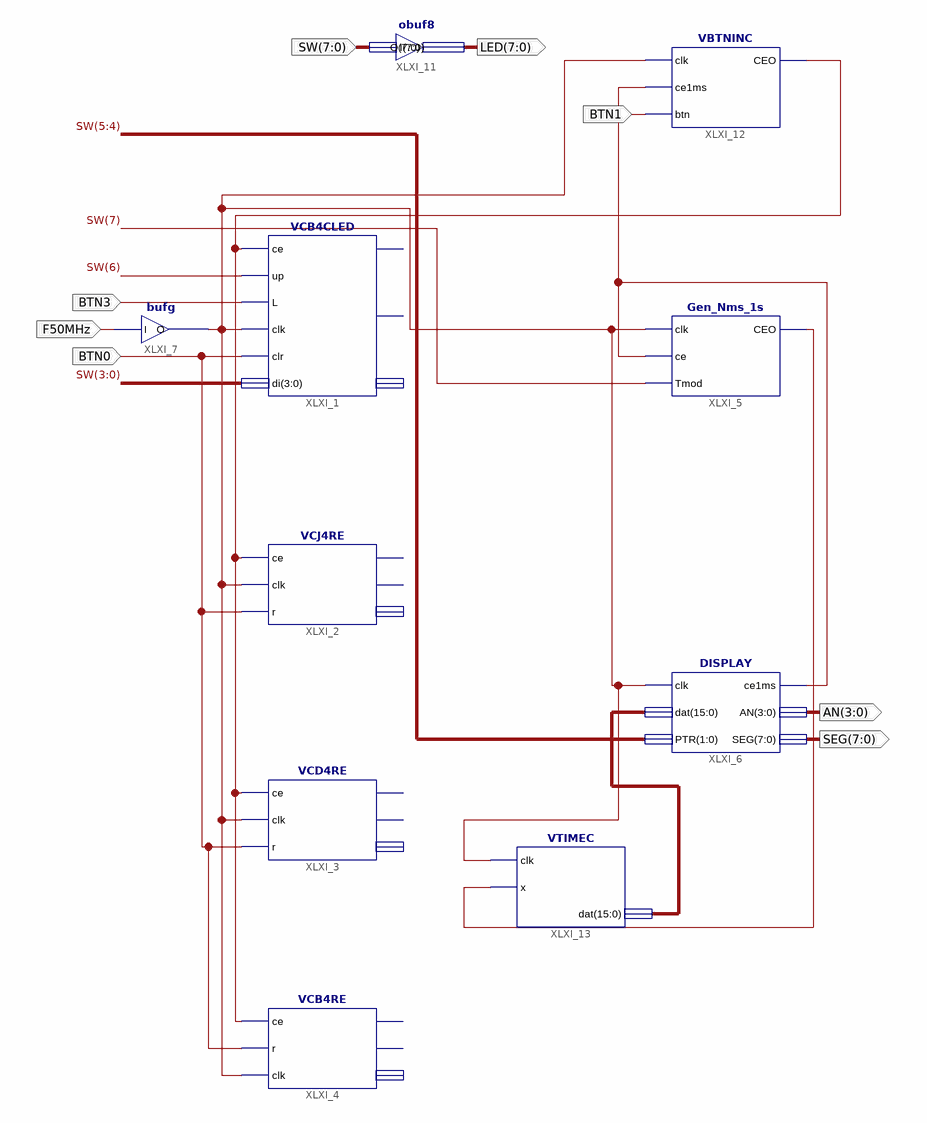
[diagram p0: schematic sheet 1]
// Xilinx ISE schematic Sch1.sch (spartan3e) as structural Verilog: 10 symbols, 8 ports
module Sch1 (
  input  BTN0,
  input  BTN3,
  input  F50MHz,
  input  [7:0] SW,
  input  BTN1,
  output [3:0] AN,
  output [7:0] SEG,
  output [7:0] LED
);

  wire XLXN_23, XLXN_24, XLXN_26, XLXN_27;
  wire [15:0] XLXN_30;

  VCB4CLED XLXI_1 (.ce(XLXN_23), .up(SW[6]), .L(BTN3), .clk(XLXN_26), .clr(BTN0), .di(SW[3:0]));  // open: CEO, TC, Q
  VCJ4RE XLXI_2 (.ce(XLXN_23), .clk(XLXN_26), .r(BTN0));  // open: TC, CEO, Q
  VCD4RE XLXI_3 (.ce(XLXN_23), .clk(XLXN_26), .r(BTN0));  // open: TC, CEO, Q
  VCB4RE XLXI_4 (.ce(XLXN_23), .r(BTN0), .clk(XLXN_26));  // open: TC, CEO, Q
  Gen_Nms_1s XLXI_5 (.clk(XLXN_26), .ce(XLXN_24), .Tmod(SW[7]), .CEO(XLXN_27));
  DISPLAY XLXI_6 (.clk(XLXN_26), .dat(XLXN_30), .PTR(SW[5:4]), .ce1ms(XLXN_24), .AN(AN), .SEG(SEG));
  bufg XLXI_7 (.I(F50MHz), .O(XLXN_26));
  obuf8 XLXI_11 (.I(SW), .O(LED));
  VBTNINC XLXI_12 (.clk(XLXN_26), .ce1ms(XLXN_24), .btn(BTN1), .CEO(XLXN_23));
  VTIMEC XLXI_13 (.clk(XLXN_26), .x(XLXN_27), .dat(XLXN_30));
endmodule
